# EAGLE schematic memory-32kx13 (EAGLE 6.6.0)

## Sheet 1 of 2
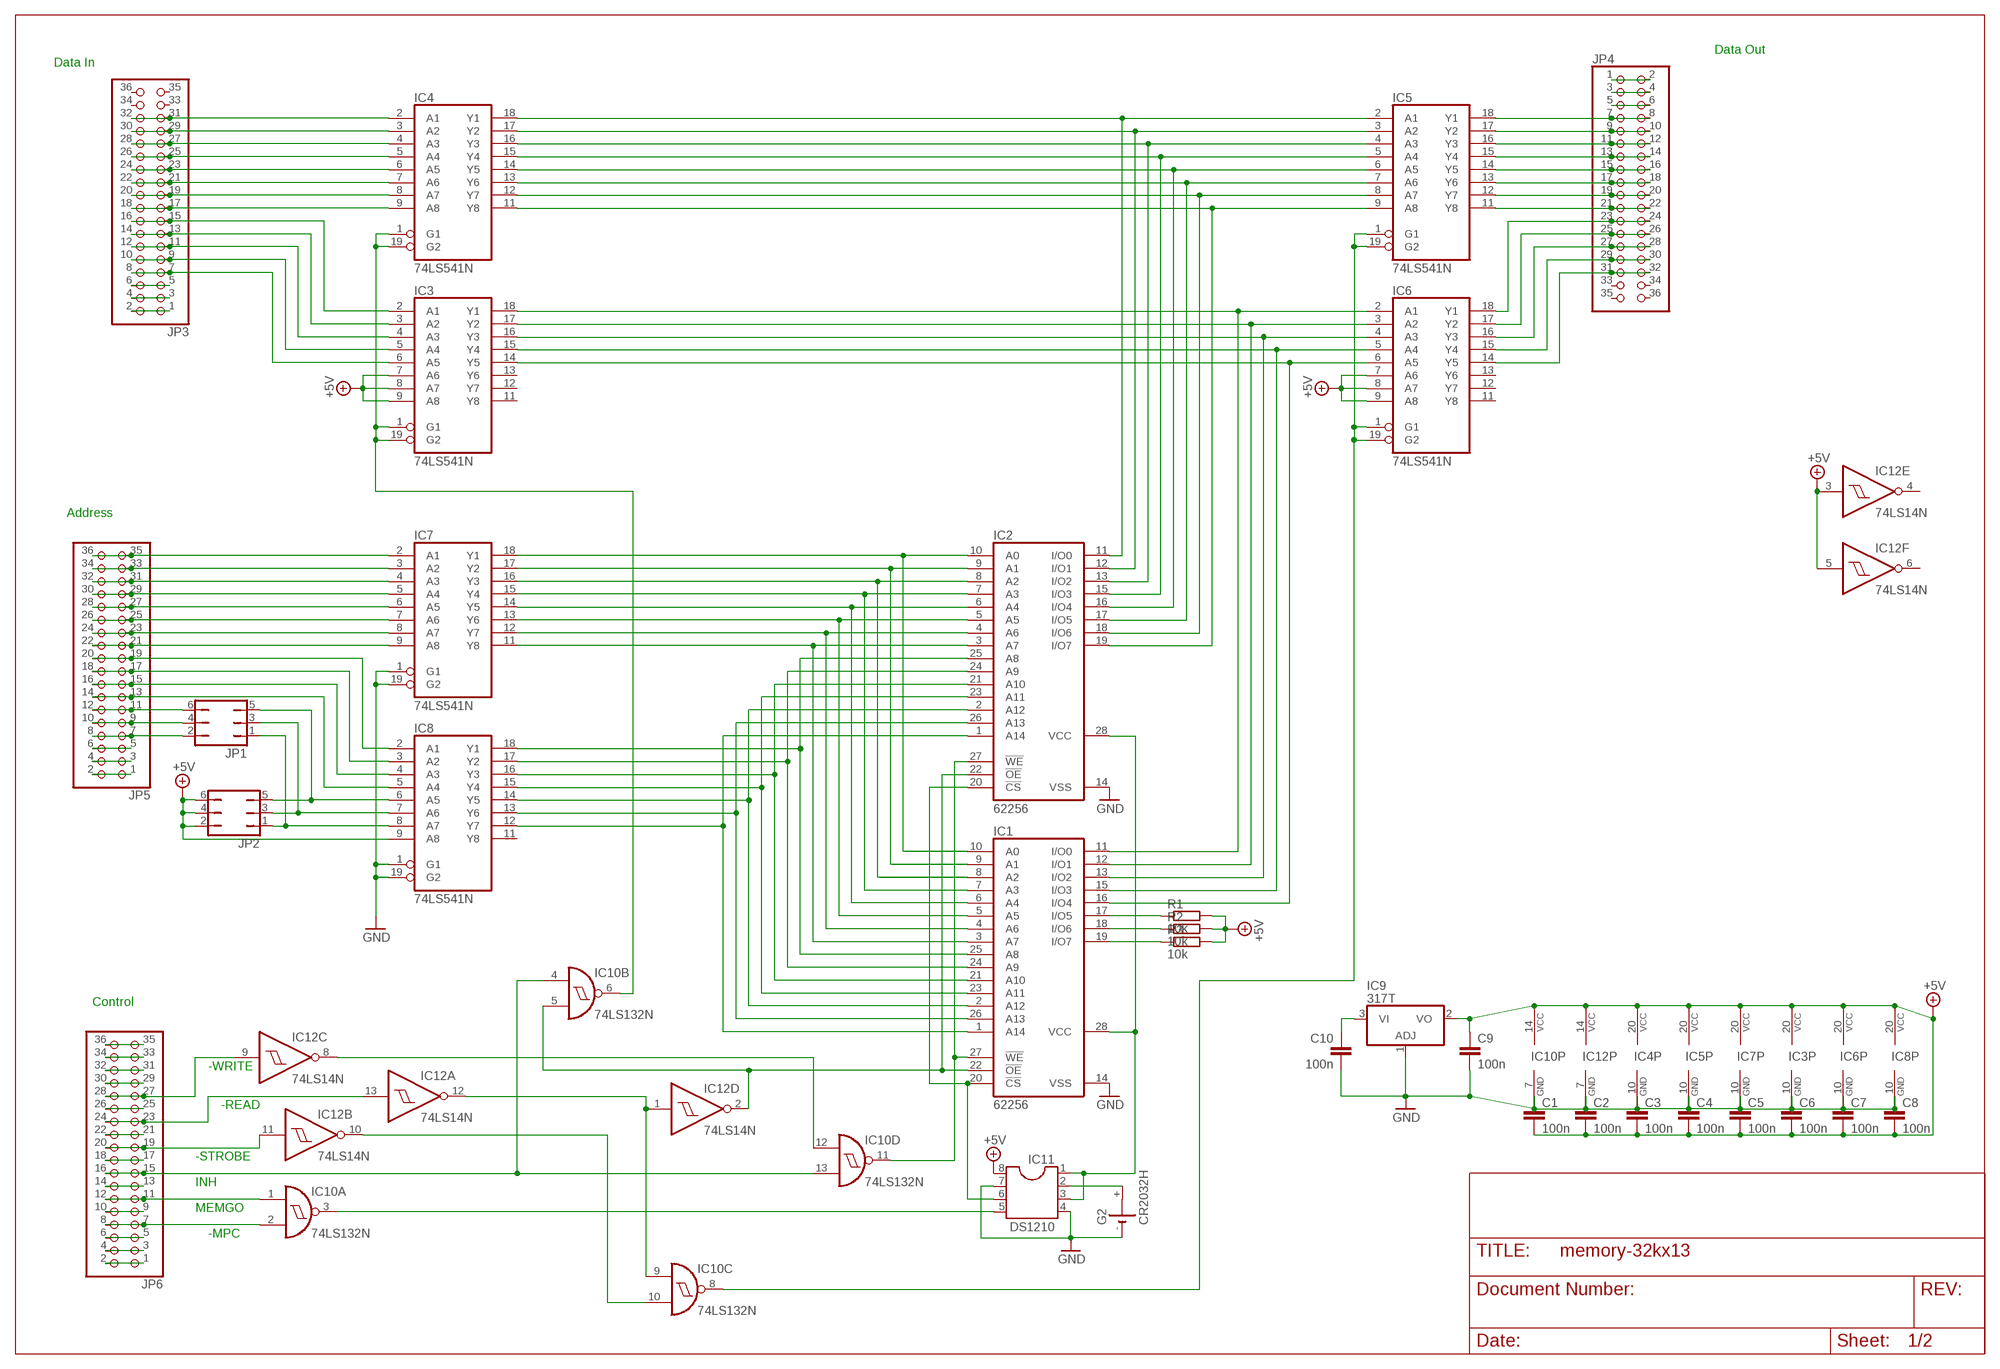
[diagram p0: schematic, sheet 1]

### Parts
C1  100n  C-EU050-024X044  [C050-024X044]
C2  100n  C-EU050-024X044  [C050-024X044]
C3  100n  C-EU050-024X044  [C050-024X044]
C4  100n  C-EU050-024X044  [C050-024X044]
C5  100n  C-EU050-024X044  [C050-024X044]
C6  100n  C-EU050-024X044  [C050-024X044]
C7  100n  C-EU050-024X044  [C050-024X044]
C8  100n  C-EU050-024X044  [C050-024X044]
C9  100n  C-EU050-024X044  [C050-024X044]
C10  100n  C-EU050-024X044  [C050-024X044]
G2  CR2032H  [CR2032H]
IC1  62256  62256P  [DIL28-6]
IC2  62256  62256P  [DIL28-6]
IC3  74LS541N  [DIL20]
IC4  74LS541N  [DIL20]
IC5  74LS541N  [DIL20]
IC6  74LS541N  [DIL20]
IC7  74LS541N  [DIL20]
IC8  74LS541N  [DIL20]
IC9  317T  [TO220H]
IC10  74LS132N  [DIL14]
IC11  DS1210  DIL8S  [SOCKET-08]
IC12  74LS14N  [DIL14]
JP1  JP3Q  [JP3Q]
JP2  JP3Q  [JP3Q]
JP3  PINHD-2X18  [2X18]
JP4  PINHD-2X18  [2X18]
JP5  PINHD-2X18  [2X18]
JP6  PINHD-2X18  [2X18]
R1  10k  R-EU_0204/7  [0204/7]
R2  10k  R-EU_0204/7  [0204/7]
R3  10k  R-EU_0204/7  [0204/7]

### Nets
+5V: C1.2 C2.2 C3.2 C4.2 C5.2 C6.2 C7.2 C8.2 C9.1 IC3.7(A6) IC3.8(A7) IC3.9(A8) IC3.20(VCC) IC4.20(VCC) IC5.20(VCC) IC6.7(A6) IC6.8(A7) IC6.9(A8) IC6.20(VCC) IC7.20(VCC) IC8.9(A8) IC8.20(VCC) IC9.2(VO) IC10.14(P:VCC) IC11.8 IC12.3(E:I) IC12.5(F:I) IC12.14(P:VCC) JP2.2 JP2.4 JP2.6 R1.2 R2.2 R3.2
GND: C1.1 C2.1 C3.1 C4.1 C5.1 C6.1 C7.1 C8.1 C9.2 C10.2 G2.- IC1.14(VSS) IC2.14(VSS) IC3.10(GND) IC4.10(GND) IC5.10(GND) IC6.10(GND) IC7.1(G1) IC7.10(GND) IC7.19(G2) IC8.1(G1) IC8.10(GND) IC8.19(G2) IC9.1(ADJ) IC10.7(P:GND) IC11.4 IC11.7 IC12.7(P:GND)
MEMGO: IC10.1(A:I0) JP6.11 JP6.12
N$1: IC3.1(G1) IC3.19(G2) IC4.1(G1) IC4.19(G2) IC10.6(B:O)
N$2: IC8.2(A1) JP5.19 JP5.20
N$3: IC8.8(A7) JP1.1 JP2.1
N$4: IC8.7(A6) JP1.3 JP2.3
N$5: IC5.1(G1) IC5.19(G2) IC6.1(G1) IC6.19(G2) IC10.8(C:O)
N$6: IC1.22(!OE) IC2.22(!OE) IC10.5(B:I1) IC12.2(D:O)
N$7: IC1.27(!WE) IC2.27(!WE) IC10.11(D:O)
N$8: IC1.17(I/O5) R1.1
N$9: IC1.18(I/O6) R2.1
N$10: IC1.19(I/O7) R3.1
N$11: IC2.11(I/O0) IC4.18(Y1) IC5.2(A1)
N$12: IC2.12(I/O1) IC4.17(Y2) IC5.3(A2)
N$13: IC2.13(I/O2) IC4.16(Y3) IC5.4(A3)
N$14: IC2.15(I/O3) IC4.15(Y4) IC5.5(A4)
N$15: IC2.16(I/O4) IC4.14(Y5) IC5.6(A5)
N$16: IC2.17(I/O5) IC4.13(Y6) IC5.7(A6)
N$17: IC2.18(I/O6) IC4.12(Y7) IC5.8(A7)
N$18: IC2.19(I/O7) IC4.11(Y8) IC5.9(A8)
N$19: IC1.12(I/O1) IC3.17(Y2) IC6.3(A2)
N$20: IC1.13(I/O2) IC3.16(Y3) IC6.4(A3)
N$21: IC1.11(I/O0) IC3.18(Y1) IC6.2(A1)
N$23: IC1.15(I/O3) IC3.15(Y4) IC6.5(A4)
N$24: IC1.10(A0) IC2.10(A0) IC7.18(Y1)
N$25: IC1.9(A1) IC2.9(A1) IC7.17(Y2)
N$26: IC1.8(A2) IC2.8(A2) IC7.16(Y3)
N$27: IC1.7(A3) IC2.7(A3) IC7.15(Y4)
N$28: IC1.6(A4) IC2.6(A4) IC7.14(Y5)
N$29: IC1.5(A5) IC2.5(A5) IC7.13(Y6)
N$30: IC1.4(A6) IC2.4(A6) IC7.12(Y7)
N$31: IC1.3(A7) IC2.3(A7) IC7.11(Y8)
N$32: IC1.16(I/O4) IC3.14(Y5) IC6.6(A5)
N$33: IC6.17(Y2) JP4.25 JP4.26
N$37: IC7.8(A7) JP5.23 JP5.24
N$38: IC7.7(A6) JP5.25 JP5.26
N$39: IC8.6(A5) JP1.5 JP2.5
N$40: G2.+ IC11.2
N$41: IC1.28(VCC) IC2.28(VCC) IC11.1 IC11.3
N$42: IC1.20(!CS) IC2.20(!CS) IC11.6
N$43: IC1.25(A8) IC2.25(A8) IC8.18(Y1)
N$44: IC1.24(A9) IC2.24(A9) IC8.17(Y2)
N$45: IC1.21(A10) IC2.21(A10) IC8.16(Y3)
N$46: IC1.23(A11) IC2.23(A11) IC8.15(Y4)
N$47: IC1.2(A12) IC2.2(A12) IC8.14(Y5)
N$48: IC4.9(A8) JP3.17 JP3.18
N$49: IC4.8(A7) JP3.19 JP3.20
N$50: IC4.7(A6) JP3.21 JP3.22
N$51: IC3.2(A1) JP3.15 JP3.16
N$52: IC3.3(A2) JP3.13 JP3.14
N$53: IC3.4(A3) JP3.11 JP3.12
N$54: IC3.5(A4) JP3.9 JP3.10
N$55: IC3.6(A5) JP3.7 JP3.8
N$56: IC6.14(Y5) JP4.31 JP4.32
N$57: IC6.15(Y4) JP4.29 JP4.30
N$58: IC6.16(Y3) JP4.27 JP4.28
N$60: IC6.18(Y1) JP4.23 JP4.24
N$61: IC5.13(Y6) JP4.17 JP4.18
N$62: IC5.12(Y7) JP4.19 JP4.20
N$63: IC5.11(Y8) JP4.21 JP4.22
N$64: IC7.6(A5) JP5.27 JP5.28
N$65: IC7.5(A4) JP5.29 JP5.30
N$66: IC10.3(A:O) IC11.5
N$67: IC10.10(C:I1) IC12.10(B:O)
N$68: JP6.25 JP6.26
N$69: JP1.2 JP5.7 JP5.8
N$70: JP1.4 JP5.9 JP5.10
N$71: JP1.6 JP5.11 JP5.12
N$72: IC10.9(C:I0) IC12.1(D:I) IC12.12(A:O)
N$73: IC10.12(D:I0) IC12.8(C:O)
N$74: IC5.14(Y5) JP4.15 JP4.16
N$75: C10.1 IC9.3(VI)
N$76: IC8.3(A2) JP5.17 JP5.18
N$77: IC7.9(A8) JP5.21 JP5.22
N$78: IC8.4(A3) JP5.15 JP5.16
N$79: IC8.5(A4) JP5.13 JP5.14
N$80: IC7.4(A3) JP5.31 JP5.32
N$81: IC7.3(A2) JP5.33 JP5.34
N$82: IC7.2(A1) JP5.35 JP5.36
N$83: IC4.6(A5) JP3.23 JP3.24
N$84: JP3.1 JP3.2
N$85: JP3.3 JP3.4
N$86: JP3.5 JP3.6
N$87: JP4.1 JP4.2
N$88: JP4.3 JP4.4
N$89: JP4.5 JP4.6
N$90: JP5.1 JP5.2
N$91: JP5.3 JP5.4
N$92: JP5.5 JP5.6
N$93: JP6.1 JP6.2
N$94: JP6.3 JP6.4
N$95: JP6.5 JP6.6
N$96: IC10.2(A:I1) JP6.7 JP6.8
N$97: JP6.9 JP6.10
N$98: IC5.15(Y4) JP4.13 JP4.14
N$99: JP6.13 JP6.14
N$100: IC10.4(B:I0) IC10.13(D:I1) JP6.15 JP6.16
N$101: JP6.17 JP6.18
N$102: IC12.11(B:I) JP6.19 JP6.20
N$103: JP6.21 JP6.22
N$104: IC12.13(A:I) JP6.23 JP6.24
N$105: IC5.16(Y3) JP4.11 JP4.12
N$106: IC12.9(C:I) JP6.27 JP6.28
N$107: JP6.29 JP6.30
N$108: JP6.31 JP6.32
N$109: JP6.33 JP6.34
N$110: JP6.35 JP6.36
N$111: IC4.5(A4) JP3.25 JP3.26
N$112: IC4.4(A3) JP3.27 JP3.28
N$113: IC4.3(A2) JP3.29 JP3.30
N$114: IC4.2(A1) JP3.31 JP3.32
N$115: IC1.26(A13) IC2.26(A13) IC8.13(Y6)
N$116: IC1.1(A14) IC2.1(A14) IC8.12(Y7)
N$117: IC5.17(Y2) JP4.9 JP4.10
N$118: IC5.18(Y1) JP4.7 JP4.8
Unconnected: G2.+@1(+) IC3.11(Y8) IC3.12(Y7) IC3.13(Y6) IC6.11(Y8) IC6.12(Y7) IC6.13(Y6) IC8.11(Y8) IC12.4(E:O) IC12.6(F:O) JP3.33 JP3.34 JP3.35 JP3.36 JP4.33 JP4.34 JP4.35 JP4.36

### Notes on the sheet
- Data Out
- Data In
- Address
- Control
- -WRITE
- -READ
- -STROBE
- INH
- MEMGO
- -MPC

## Sheet 2 of 2
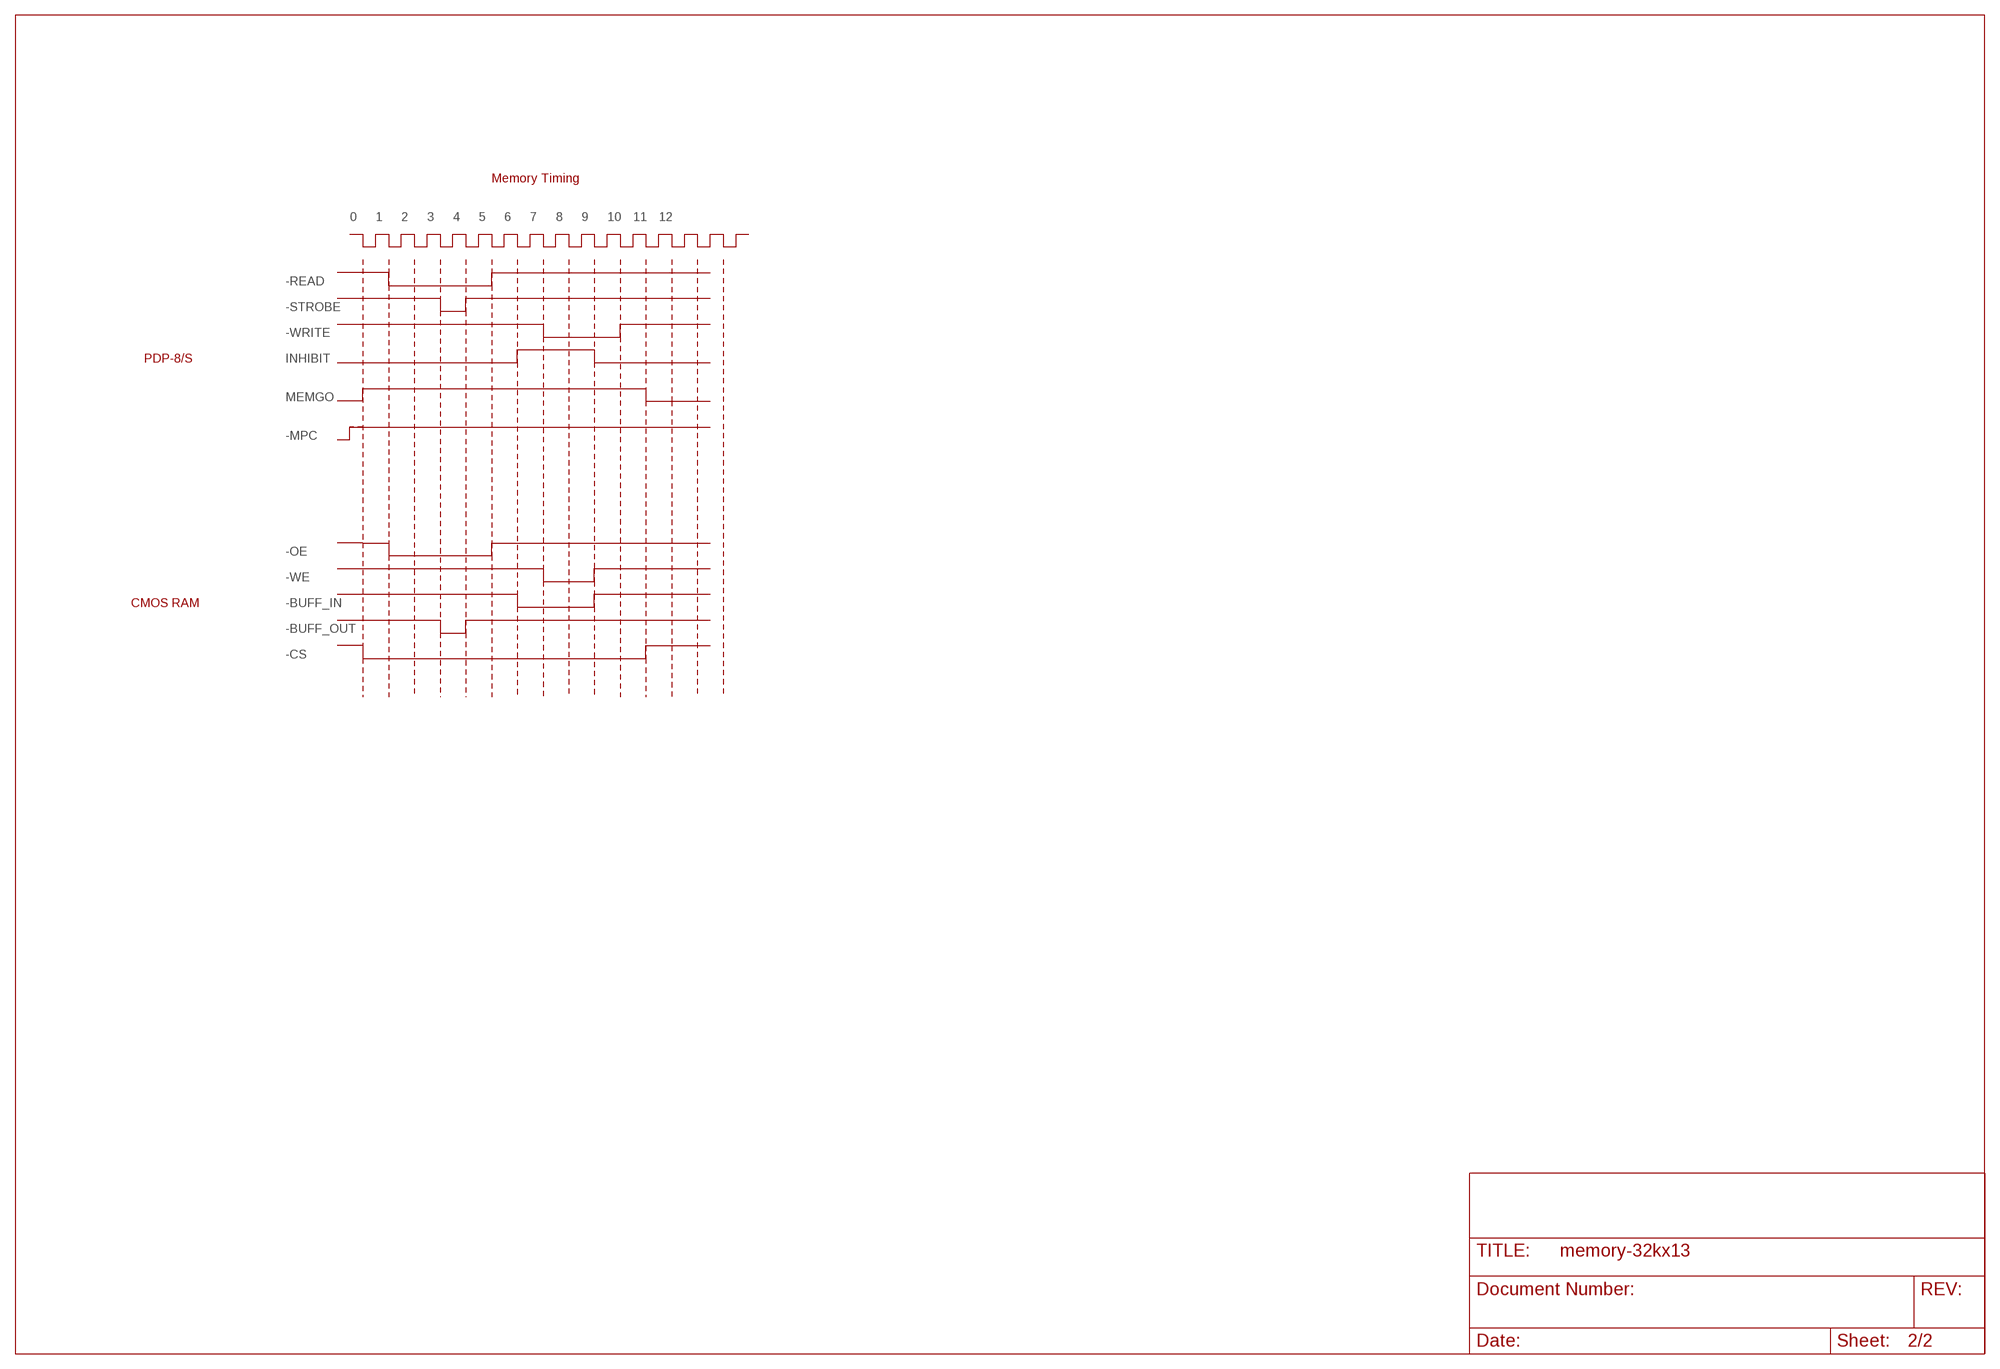
[diagram p1: schematic, sheet 2]

### Notes on the sheet
- Memory Timing
- 0 | 1 | 2 | 3 | 4 | 5 | 6 | 7 | 8 | 9 | 10 | 11 | 12
- -READ
- -STROBE
- -WRITE
- PDP-8/S | INHIBIT
- MEMGO
- -MPC
- -OE
- -WE
- CMOS RAM | -BUFF_IN
- -BUFF_OUT
- -CS

## Library data of the parts
C1-C10 = rcl:C-EU: CAPACITOR, European symbol
G2 = battery:CR2032H: LI BATTERY Varta
IC1 IC2 = memory-hitachi:62256P: MEMORY; OC_FARNELL: unknown; OC_NEWARK: unknown
IC3-IC8 = 74xx-us:74*541: Octal BUFFER and LINE DRIVER, 3-state
IC9 = linear:*317: Positive VOLTAGE REGULATOR
IC10 = 74xx-us:74*132: Quad 2-input NAND schmitt trigger
IC11 = ic-package:DIL8: Dual In Line / Socket
IC12 = 74xx-us:74*14: Hex schmitt trigger INVERTER
JP1 JP2 = jumper:JP3Q: JUMPER
JP3-JP6 = pinhead:PINHD-2X18: PIN HEADER
R1-R3 = rcl:R-EU_: RESISTOR, European symbol